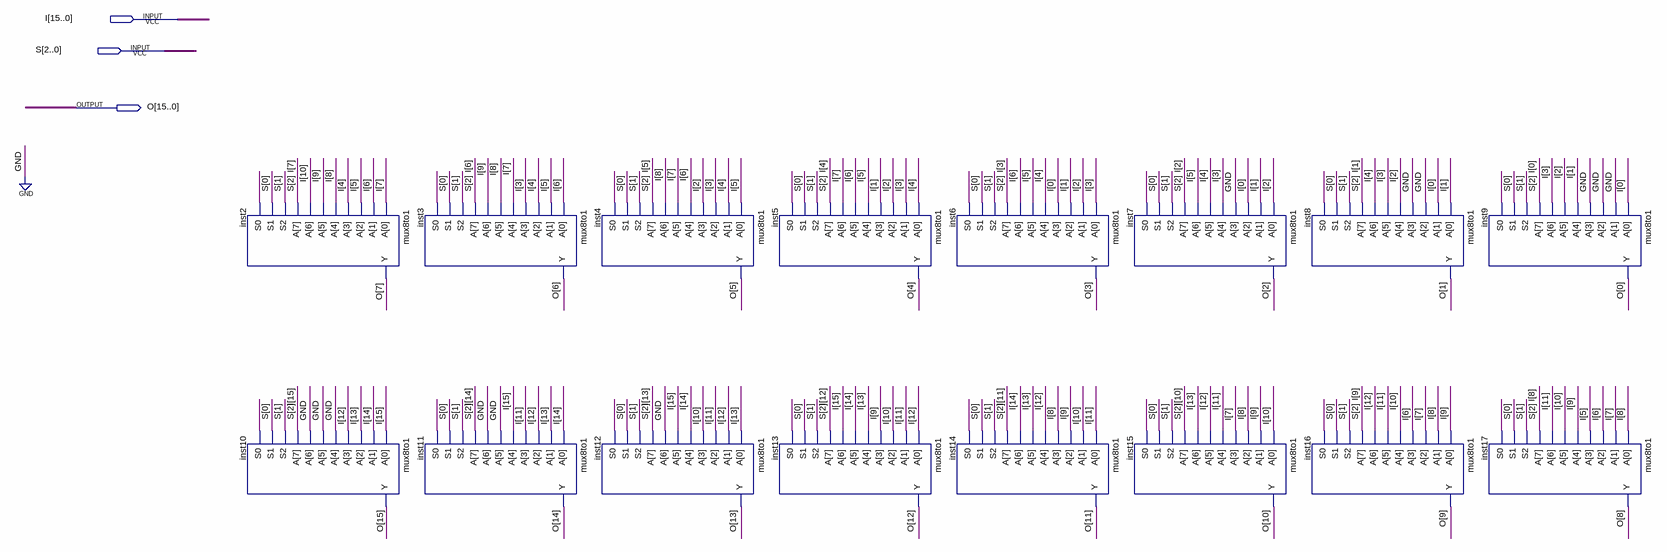
[diagram p0: schematic sheet]
// Quartus schematic SHIFTER.bdf as structural Verilog: 16 symbols, 3 pins
module SHIFTER (
  input  [15:0] I,
  input  [2:0] S,
  output [15:0] O
);

  mux8to1 inst2 (.A({I[7], I[10:8], I[4], I[5], I[6], I[7]}), .S2(S[2]), .S1(S[1]), .S0(S[0]), .Y(O[7]));
  mux8to1 inst10 (.A({I[15], 3'b000, I[12], I[13], I[14], I[15]}), .S2(S[2]), .S1(S[1]), .S0(S[0]), .Y(O[15]));
  mux8to1 inst3 (.A({I[6], I[9:7], I[3], I[4], I[5], I[6]}), .S2(S[2]), .S1(S[1]), .S0(S[0]), .Y(O[6]));
  mux8to1 inst11 (.A({I[14], 2'b00, I[15], I[11], I[12], I[13], I[14]}), .S2(S[2]), .S1(S[1]), .S0(S[0]), .Y(O[14]));
  mux8to1 inst4 (.A({I[5], I[8:6], I[2], I[3], I[4], I[5]}), .S2(S[2]), .S1(S[1]), .S0(S[0]), .Y(O[5]));
  mux8to1 inst12 (.A({I[13], 1'b0, I[15:14], I[10], I[11], I[12], I[13]}), .S2(S[2]), .S1(S[1]), .S0(S[0]), .Y(O[13]));
  mux8to1 inst5 (.A({I[4], I[7:5], I[1], I[2], I[3], I[4]}), .S2(S[2]), .S1(S[1]), .S0(S[0]), .Y(O[4]));
  mux8to1 inst13 (.A({I[12], I[15:13], I[9], I[10], I[11], I[12]}), .S2(S[2]), .S1(S[1]), .S0(S[0]), .Y(O[12]));
  mux8to1 inst6 (.A({I[3], I[6:4], I[0], I[1], I[2], I[3]}), .S2(S[2]), .S1(S[1]), .S0(S[0]), .Y(O[3]));
  mux8to1 inst14 (.A({I[11], I[14:12], I[8], I[9], I[10], I[11]}), .S2(S[2]), .S1(S[1]), .S0(S[0]), .Y(O[11]));
  mux8to1 inst7 (.A({I[2], I[5:3], 1'b0, I[0], I[1], I[2]}), .S2(S[2]), .S1(S[1]), .S0(S[0]), .Y(O[2]));
  mux8to1 inst15 (.A({I[10], I[13:11], I[7], I[8], I[9], I[10]}), .S2(S[2]), .S1(S[1]), .S0(S[0]), .Y(O[10]));
  mux8to1 inst8 (.A({I[1], I[4:2], 2'b00, I[0], I[1]}), .S2(S[2]), .S1(S[1]), .S0(S[0]), .Y(O[1]));
  mux8to1 inst16 (.A({I[9], I[12:10], I[6], I[7], I[8], I[9]}), .S2(S[2]), .S1(S[1]), .S0(S[0]), .Y(O[9]));
  mux8to1 inst9 (.A({I[0], I[3:1], 3'b000, I[0]}), .S2(S[2]), .S1(S[1]), .S0(S[0]), .Y(O[0]));
  mux8to1 inst17 (.A({I[8], I[11:9], I[5], I[6], I[7], I[8]}), .S2(S[2]), .S1(S[1]), .S0(S[0]), .Y(O[8]));
endmodule
